# Altium schematic sheet InvertedLayer.SchDoc: Inverted Layer
size A4; ApprovedBy: Anthony Chiam; CheckedBy: Anthony Chiam; Author: Anthony Chiam; DrawnBy: Anthony Chiam; Engineer: Anthony Chiam; Revision: Rev2; SheetNumber: 2; SheetTotal: 2
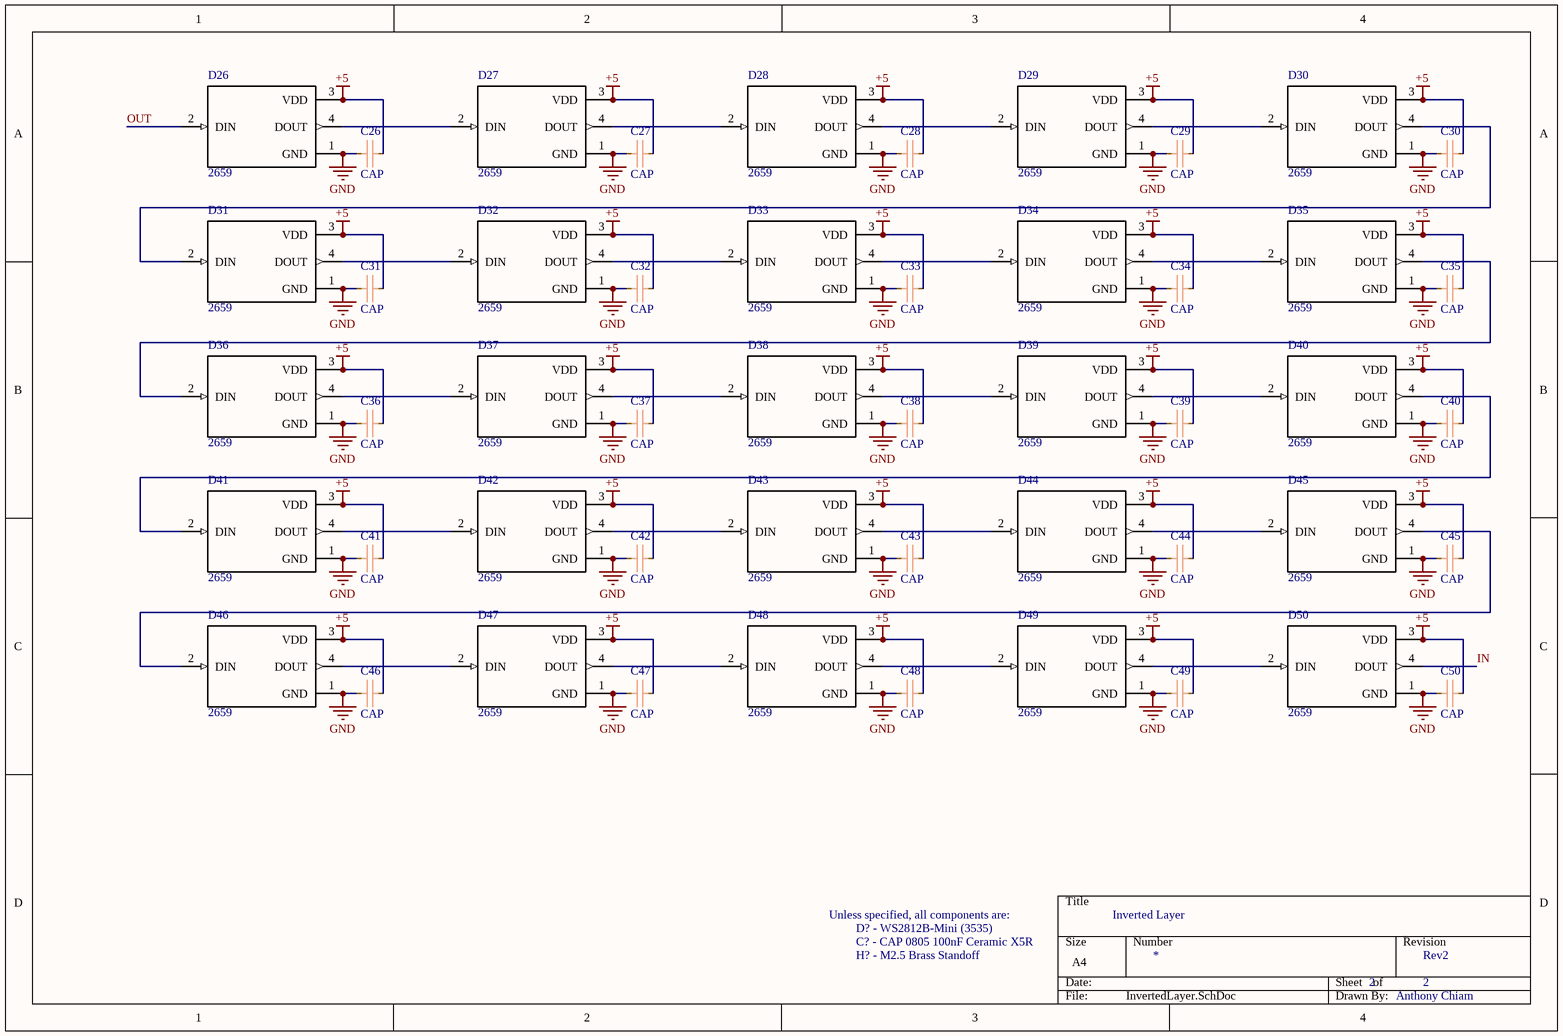
[diagram p0: InvertedLayer.SchDoc]

## Parts
C26  CAP  [C0805]
C27  CAP  [C0805]
C28  CAP  [C0805]
C29  CAP  [C0805]
C30  CAP  [C0805]
C31  CAP  [C0805]
C32  CAP  [C0805]
C33  CAP  [C0805]
C34  CAP  [C0805]
C35  CAP  [C0805]
C36  CAP  [C0805]
C37  CAP  [C0805]
C38  CAP  [C0805]
C39  CAP  [C0805]
C40  CAP  [C0805]
C41  CAP  [C0805]
C42  CAP  [C0805]
C43  CAP  [C0805]
C44  CAP  [C0805]
C45  CAP  [C0805]
C46  CAP  [C0805]
C47  CAP  [C0805]
C48  CAP  [C0805]
C49  CAP  [C0805]
C50  CAP  [C0805]
D26  2659  [WS2812B-3535]
D27  2659  [WS2812B-3535]
D28  2659  [WS2812B-3535]
D29  2659  [WS2812B-3535]
D30  2659  [WS2812B-3535]
D31  2659  [WS2812B-3535]
D32  2659  [WS2812B-3535]
D33  2659  [WS2812B-3535]
D34  2659  [WS2812B-3535]
D35  2659  [WS2812B-3535]
D36  2659  [WS2812B-3535]
D37  2659  [WS2812B-3535]
D38  2659  [WS2812B-3535]
D39  2659  [WS2812B-3535]
D40  2659  [WS2812B-3535]
D41  2659  [WS2812B-3535]
D42  2659  [WS2812B-3535]
D43  2659  [WS2812B-3535]
D44  2659  [WS2812B-3535]
D45  2659  [WS2812B-3535]
D46  2659  [WS2812B-3535]
D47  2659  [WS2812B-3535]
D48  2659  [WS2812B-3535]
D49  2659  [WS2812B-3535]
D50  2659  [WS2812B-3535]

## Nets
+5: C26.2(N/A) C27.2(N/A) C28.2(N/A) C29.2(N/A) C30.2(N/A) C31.2(N/A) C32.2(N/A) C33.2(N/A) C34.2(N/A) C35.2(N/A) C36.2(N/A) C37.2(N/A) C38.2(N/A) C39.2(N/A) C40.2(N/A) C41.2(N/A) C42.2(N/A) C43.2(N/A) C44.2(N/A) C45.2(N/A) C46.2(N/A) C47.2(N/A) C48.2(N/A) C49.2(N/A) C50.2(N/A) D26.3(VDD) D27.3(VDD) D28.3(VDD) D29.3(VDD) D30.3(VDD) D31.3(VDD) D32.3(VDD) D33.3(VDD) D34.3(VDD) D35.3(VDD) D36.3(VDD) D37.3(VDD) D38.3(VDD) D39.3(VDD) D40.3(VDD) D41.3(VDD) D42.3(VDD) D43.3(VDD) D44.3(VDD) D45.3(VDD) D46.3(VDD) D47.3(VDD) D48.3(VDD) D49.3(VDD) D50.3(VDD)
GND: C26.1(N/A) C27.1(N/A) C28.1(N/A) C29.1(N/A) C30.1(N/A) C31.1(N/A) C32.1(N/A) C33.1(N/A) C34.1(N/A) C35.1(N/A) C36.1(N/A) C37.1(N/A) C38.1(N/A) C39.1(N/A) C40.1(N/A) C41.1(N/A) C42.1(N/A) C43.1(N/A) C44.1(N/A) C45.1(N/A) C46.1(N/A) C47.1(N/A) C48.1(N/A) C49.1(N/A) C50.1(N/A) D26.1(GND) D27.1(GND) D28.1(GND) D29.1(GND) D30.1(GND) D31.1(GND) D32.1(GND) D33.1(GND) D34.1(GND) D35.1(GND) D36.1(GND) D37.1(GND) D38.1(GND) D39.1(GND) D40.1(GND) D41.1(GND) D42.1(GND) D43.1(GND) D44.1(GND) D45.1(GND) D46.1(GND) D47.1(GND) D48.1(GND) D49.1(GND) D50.1(GND)
IN: D50.4(DOUT)
OUT: D26.2(DIN)
NetD26_4: D26.4(DOUT) D27.2(DIN)
NetD27_4: D27.4(DOUT) D28.2(DIN)
NetD28_4: D28.4(DOUT) D29.2(DIN)
NetD29_4: D29.4(DOUT) D30.2(DIN)
NetD30_4: D30.4(DOUT) D31.2(DIN)
NetD31_4: D31.4(DOUT) D32.2(DIN)
NetD32_4: D32.4(DOUT) D33.2(DIN)
NetD33_4: D33.4(DOUT) D34.2(DIN)
NetD34_4: D34.4(DOUT) D35.2(DIN)
NetD35_4: D35.4(DOUT) D36.2(DIN)
NetD36_4: D36.4(DOUT) D37.2(DIN)
NetD37_4: D37.4(DOUT) D38.2(DIN)
NetD38_4: D38.4(DOUT) D39.2(DIN)
NetD39_4: D39.4(DOUT) D40.2(DIN)
NetD40_4: D40.4(DOUT) D41.2(DIN)
NetD41_4: D41.4(DOUT) D42.2(DIN)
NetD42_4: D42.4(DOUT) D43.2(DIN)
NetD43_4: D43.4(DOUT) D44.2(DIN)
NetD44_4: D44.4(DOUT) D45.2(DIN)
NetD45_4: D45.4(DOUT) D46.2(DIN)
NetD46_4: D46.4(DOUT) D47.2(DIN)
NetD47_4: D47.4(DOUT) D48.2(DIN)
NetD48_4: D48.4(DOUT) D49.2(DIN)
NetD49_4: D49.4(DOUT) D50.2(DIN)

## Notes on the sheet
- Unless specified, all components are:
- D? - WS2812B-Mini (3535)
- C? - CAP 0805 100nF Ceramic X5R
- H? - M2.5 Brass Standoff

## Library data of the parts
C26-C50 = CAP: Capacitor
D26-D50 = WS2812B-3535: MF: Adafruit Industries; MP: 2659; Price: None; Availability: Unavailable; SnapEDA_Link: https://www.snapeda.com/parts/2659/Adafruit%20Industries%20LLC/view-part/?ref=snap; Package: TQFP-32 Adafruit Industries; Value: *